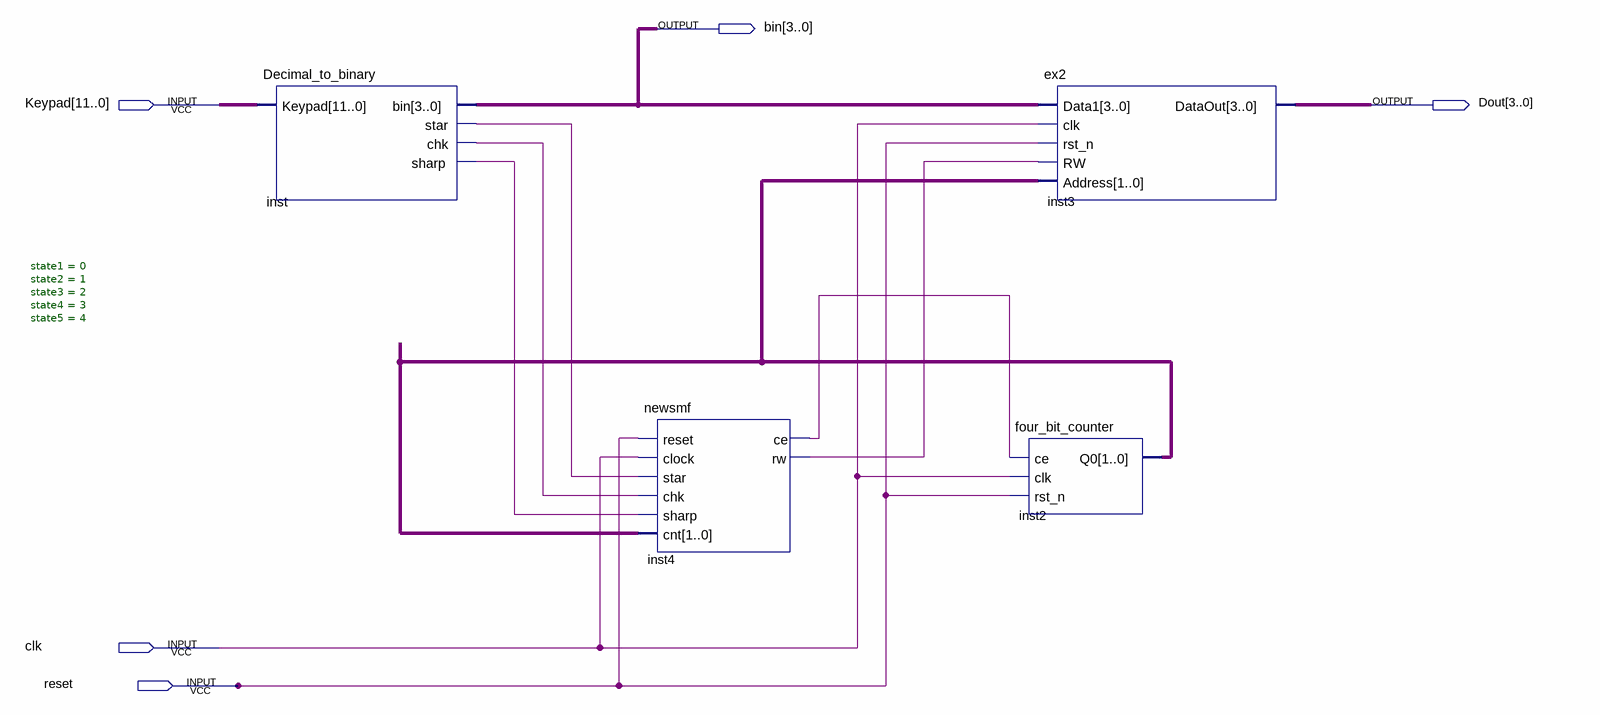
[diagram p0: schematic sheet]
// Quartus schematic six2.bdf as structural Verilog: 4 symbols, 5 pins
module six2 (
  input  [11:0] Keypad,
  input  clk,
  input  reset,
  output [3:0] bin,
  output [3:0] Dout
);

  wire inst4_ce, inst4_rw, inst_chk, inst_sharp, inst_star;
  wire [1:0] inst2_q0;

  Decimal_to_binary inst (.Keypad(Keypad), .bin(bin), .star(inst_star), .chk(inst_chk), .sharp(inst_sharp));
  newsmf #(.state1(0), .state2(1), .state3(2), .state4(3), .state5(4)) inst4 (
    .reset(reset), .clock(clk), .star(inst_star), .chk(inst_chk), .sharp(inst_sharp), .cnt(inst2_q0),
    .ce(inst4_ce), .rw(inst4_rw));
  four_bit_counter inst2 (.ce(inst4_ce), .clk(clk), .rst_n(reset), .Q0(inst2_q0));
  ex2 inst3 (.Data1(bin), .clk(clk), .rst_n(reset), .RW(inst4_rw), .Address(inst2_q0), .DataOut(Dout));
endmodule
